# Altium project Smart wrist Band.PrjPcb
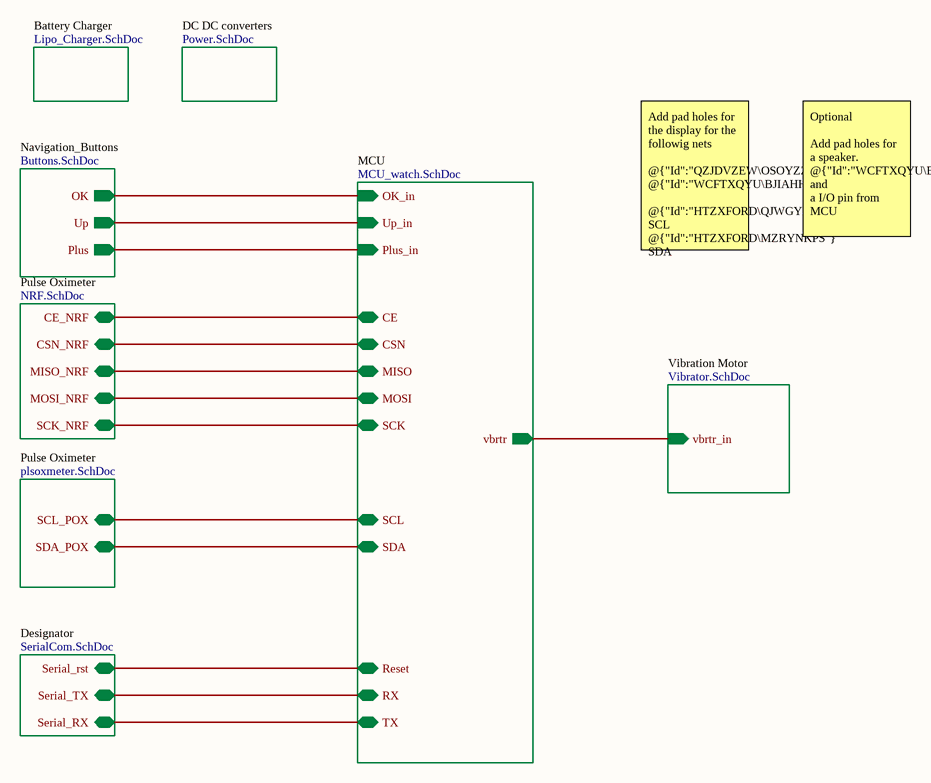
[diagram p0: Wrist watch main.SchDoc]
8 sheets, 63 parts. Net scope: hierarchical (ports join the sheet entries above them; power ports are global).
Sheets:
  Wrist watch main.SchDoc
    MCU = MCU_watch.SchDoc
    Pulse Oximeter = plsoxmeter.SchDoc
    Vibration Motor = Vibrator.SchDoc
    Navigation_Buttons = Buttons.SchDoc
  USB.SchDoc
  VRegulator.SchDoc
  Buck_converter.SchDoc

## Sheet Wrist watch main.SchDoc: Wrist watch main
size A4; Subtitle: Subtitle; Project: Stearsafe; VersionRevision: VersionRevision; TotalSheet: TotalSheet; Author: Sajitha Madugalle; Revision: 1; SheetNumber: 1; SheetTotal: 9

### Sub-sheets
Battery Charger = Lipo_Charger.SchDoc (file not in this document): no entries
DC DC converters = Power.SchDoc (file not in this document): no entries
Designator = SerialCom.SchDoc (file not in this document): Serial_rst (bidir), Serial_TX (bidir), Serial_RX (bidir)
MCU = MCU_watch.SchDoc: SDA (bidir), SCL (bidir), OK_in (in), Up_in (in), Plus_in (in), vbrtr (out), CE (bidir), CSN (bidir), MISO (bidir), MOSI (bidir), SCK (bidir), Reset (bidir), RX (bidir), TX (bidir)
Navigation_Buttons = Buttons.SchDoc: OK (out), Up (out), Plus (out)
Pulse Oximeter = plsoxmeter.SchDoc: SCL_POX (bidir), SDA_POX (bidir)
Pulse Oximeter = NRF.SchDoc (file not in this document): CE_NRF (bidir), CSN_NRF (bidir), MISO_NRF (bidir), MOSI_NRF (bidir), SCK_NRF (bidir)
Vibration Motor = Vibrator.SchDoc: vbrtr_in (in)

### Nets
RST: sheet MCU/Reset, sheet Designator/Serial_rst
SW1: sheet MCU/Up_in, sheet Navigation_Buttons/Up
SW2: sheet MCU/OK_in, sheet Navigation_Buttons/OK
SW3: sheet MCU/Plus_in, sheet Navigation_Buttons/Plus
NetIC2_2: sheet MCU/SCL, sheet Pulse Oximeter/SCL_POX
NetIC2_3: sheet MCU/SDA, sheet Pulse Oximeter/SDA_POX
NetR10_1: sheet MCU/vbrtr, sheet Vibration Motor/vbrtr_in
NetU1_11: sheet MCU/CSN, sheet Pulse Oximeter/CSN_NRF
NetU1_12: sheet MCU/CE, sheet Pulse Oximeter/CE_NRF
NetU1_15: sheet MCU/MOSI, sheet Pulse Oximeter/MOSI_NRF
NetU1_16: sheet MCU/MISO, sheet Pulse Oximeter/MISO_NRF
NetU1_17: sheet MCU/SCK, sheet Pulse Oximeter/SCK_NRF
NetU1_30: sheet MCU/RX, sheet Designator/Serial_TX
NetU1_31: sheet MCU/TX, sheet Designator/Serial_RX

### Notes on the sheet
- Add pad holes for the display for the followig nets
  @{"Id":"QZJDVZEW\OSOYZZOG"} @{"Id":"WCFTXQYU\BJIAHHOM"}
  @{"Id":"HTZXFORD\QJWGYBCR"} SCL
  @{"Id":"HTZXFORD\MZRYNKPS"} SDA
- Optional
  Add pad holes for a speaker. @{"Id":"WCFTXQYU\BJIAHHOM"} and
  a I/O pin from MCU
- Title:
- Size:
- Document Number :
- Revision
- Drawn by:
- Checked by:
- Date:
- A4
- Time:
- Aprooved by:
- Sheet:
- of
- File:

## Sheet MCU_watch.SchDoc: MCU_Watch
size A4; Author: Sajitha Madugalle; Revision: 1; SheetNumber: 5; SheetTotal: 8
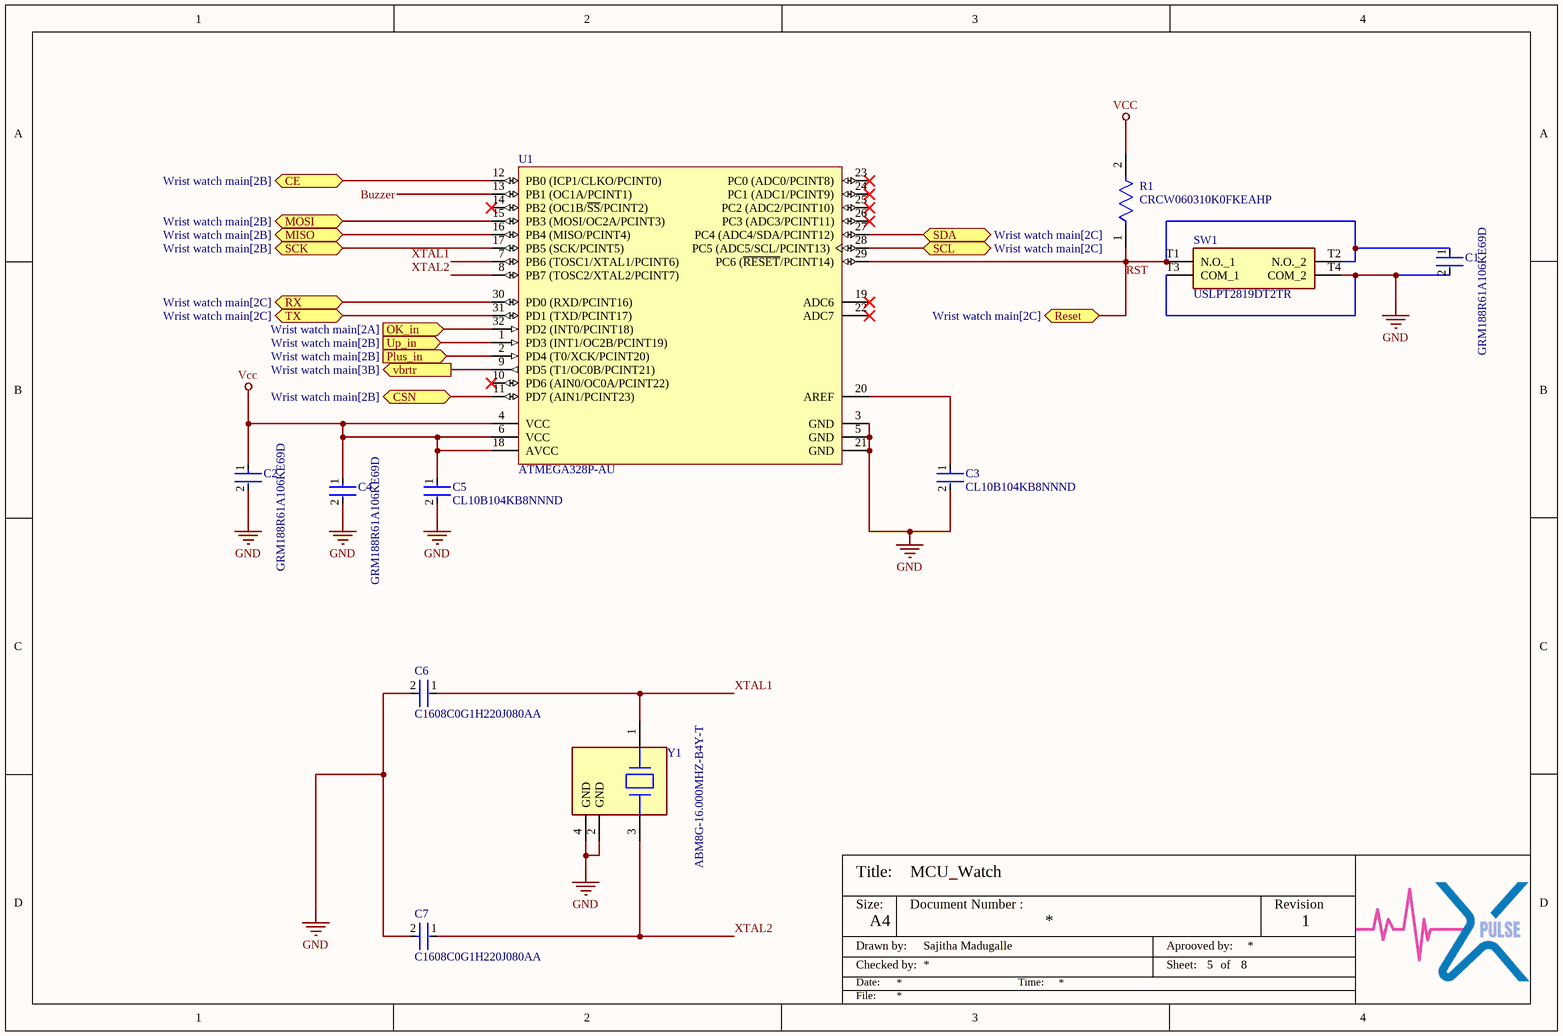
[diagram p1: MCU_watch.SchDoc]

### Parts
C1  GRM188R61A106KE69D  [FP-GRM18-0_15-MFG]
C2  GRM188R61A106KE69D  [FP-GRM18-0_15-MFG]
C3  CL10B104KB8NNND  [FP-CL10-IPC_A]
C4  GRM188R61A106KE69D  [FP-GRM18-0_15-MFG]
C5  CL10B104KB8NNND  [FP-CL10-IPC_A]
C6  C1608C0G1H220J080AA  [FP-C1608-080-0_1-IPC_B]
C7  C1608C0G1H220J080AA  [FP-C1608-080-0_1-IPC_B]
R1  CRCW060310K0FKEAHP  [FP-CRCW0603-HPe3-MFG]
SW1  USLPT2819DT2TR  [USLPT2819DT2TR]
U1  ATMEGA328P-AU  [ATML-32A_M]
Y1  ABM8G-16.000MHZ-B4Y-T  [FP-ABM8G-MFG]

### Ports
CE (bidir, see Wrist watch main[2B]), CSN (bidir, see Wrist watch main[2B]), MISO (bidir, see Wrist watch main[2B]), MOSI (bidir, see Wrist watch main[2B]), OK_in (in, see Wrist watch main[2A]), Plus_in (in, see Wrist watch main[2B]), Reset (bidir, see Wrist watch main[2C]), RX (bidir, see Wrist watch main[2C]), SCK (bidir, see Wrist watch main[2B]), SCL (bidir, see Wrist watch main[2C]), SDA (bidir, see Wrist watch main[2C]), TX (bidir, see Wrist watch main[2C]), Up_in (in, see Wrist watch main[2B]), vbrtr (out, see Wrist watch main[3B])

### Nets
GND: C1.2 C2.2 C3.2 C4.2 C5.2 C6.2 C7.2 SW1.T3(COM_1) SW1.T4(COM_2) U1.3(GND) U1.5(GND) U1.21(GND) Y1.2(GND) Y1.4(GND)
Vcc: C2.1 C4.1 C5.1 R1.2 U1.4(VCC) U1.6(VCC) U1.18(AVCC)
Buzzer: U1.13(PB1_(OC1A/PCINT1))
RST: C1.1 R1.1 SW1.T1(N.O._1) SW1.T2(N.O._2) U1.29(PC6_(~{RESET}/PCINT14)) ; port Reset
SW1: U1.1(PD3_(INT1/OC2B/PCINT19)) ; port Up_in
SW2: U1.32(PD2_(INT0/PCINT18)) ; port OK_in
SW3: U1.2(PD4_(T0/XCK/PCINT20)) ; port Plus_in
XTAL1: C6.1 U1.7(PB6_(TOSC1/XTAL1/PCINT6)) Y1.1
XTAL2: C7.1 U1.8(PB7_(TOSC2/XTAL2/PCINT7)) Y1.3
NetC3_1: C3.1 U1.20(AREF)
NetIC2_2: U1.28(PC5_(ADC5/SCL/PCINT13)) ; port SCL
NetIC2_3: U1.27(PC4_(ADC4/SDA/PCINT12)) ; port SDA
NetR10_1: U1.9(PD5_(T1/OC0B/PCINT21)) ; port vbrtr
NetU1_11: U1.11(PD7_(AIN1/PCINT23)) ; port CSN
NetU1_12: U1.12(PB0_(ICP1/CLKO/PCINT0)) ; port CE
NetU1_15: U1.15(PB3_(MOSI/OC2A/PCINT3)) ; port MOSI
NetU1_16: U1.16(PB4_(MISO/PCINT4)) ; port MISO
NetU1_17: U1.17(PB5_(SCK/PCINT5)) ; port SCK
NetU1_30: U1.30(PD0_(RXD/PCINT16)) ; port RX
NetU1_31: U1.31(PD1_(TXD/PCINT17)) ; port TX

Not connected (* = marked no-connect by the designer): U1 10(PD6_(AIN0/OC0A/PCINT22))* 14(PB2_(OC1B/~{SS}/PCINT2))* 19(ADC6)* 22(ADC7)* 23(PC0_(ADC0/PCINT8))* 24(PC1_(ADC1/PCINT9))* 25(PC2_(ADC2/PCINT10))* 26(PC3_(ADC3/PCINT11))*

### Notes on the sheet
- Title:
- Size:
- Document Number :
- Revision
- Drawn by:
- Checked by:
- Date:
- A4
- Time:
- Aprooved by:
- Sheet:
- of
- File:

### Library data of the parts
C1 C2 C4 = CMP-2000-05448-2: CAP CER 10UF 10V X5R 0603; Manufacturer: Murata; Temperature Coefficient: 15%; Material: Ceramic; Tolerance: 10%; Device Class L1: Passive Components; ComponentLink2Description: Datasheet; Height: 0.95mm; Package: GRM18-0.15; Octopart: https://octopart.com/grm188r61a106ke69d-murata-22851381; Manufacturer Part Number: GRM188R61A106KE69D; Value: 10uF; Digikey Description: CAP CER 10UF 10V X5R 0603; Temperature Range High: +85°C; Temperature Range Low: -55°C; Temperature Characteristic: X5R; Capacitance: 10uF; RoHS: TRUE; Device Class L2: Capacitors; ComponentLink2URL: https://search.murata.co.jp/Ceramy/image/img/A01X/G101/ENG/GRM188R61A106KE69-01A.pdf; Device Class L3: Ceramic Capacitors; Lead Free: Yes; Mouser Description: Multilayer Ceramic Capacitors MLCC - SMD/SMT 0603 10uF 10volts X5R + - 10%; Category: Cap; Voltage Rating: 10V; Temperature: -55°C to +85°C; Automotive: No
C3 C5 = CMP-13271-000587-1: Cap Ceramic 100nF 50V X7R ±10% Pad SMD 0603 +125°C T/R; Case/Package: 0603; Depth: 0.8mm; Max Operating Temperature: 125°C; Lead Free: Lead Free; Material: Ceramic; Voltage Rating: 50V; Min Operating Temperature: -55°C; Voltage Rating (DC): 50V; Dielectric: X7R; Height: 0.8mm; Capacitance: 100nF; Thickness: 0.035inch; Radiation Hardening: No; Voltage: 50V; Packaging: Tape and Reel; Length: 1.6mm; Tolerance: 10%; Width: 0.031inch; Mount: Surface Mount; Package Quantity: 10000
C6 C7 = CMP-2000-06024-2: CAP CER 22PF 50V C0G 0603; Tolerance: 5%; Temperature Coefficient: 30ppm/°C; Dielectric Material: Ceramic; Packaging: Tape and Reel; Termination: SMD/SMT; Case Code (Imperial): 0603; Height: 0.8mm; Capacitance: 22pF; Voltage: 50V; RoHS Compliant: Yes; Voltage Rating: 50V; Depth: 0.8mm; Case Code (Metric): 1608; Voltage Rating (DC): 50V; Construction: Flat; Max Operating Temperature: 125°C; Radiation Hardening: No; Lead Free: Lead Free; Number of Pins: 2; Case/Package: 0603; Thickness: 0.037inch; Min Operating Temperature: -55°C; Width: 0.031inch; Mount: Surface Mount; Weight: 7.1E-05oz; Series: C; Dielectric: C0G; Package Quantity: 1; Length: 1.6mm
R1 = CMP-2000-03835-2: RES SMD 10K OHM 1% 1/3W 0603; Resistance: 10kR; Voltage Rating (DC): 75V; Max Power Dissipation: 250mW; Temperature Coefficient: 100ppm/°C; Case Code (Metric): 1608; Features: Automotive AEC-Q200; Termination: SMD/SMT; Number of Terminations: 2; Case Code (Imperial): 0603; Tolerance: 1%; Depth: 0.85mm; Package Quantity: 10; Length: 1.6mm; Packaging: Tape and Reel; Contact Plating: Tin; Radiation Hardening: No; Case/Package: 0603; Composition: Thick Film; Voltage Rating: 75V; Weight: 7.1E-05oz; Max Operating Temperature: 155°C; Lead Free: Lead Free; Width: 0.033inch; Power Rating: 250mW; Min Operating Temperature: -55°C; Military Standard: Not; Height: 0.45mm
SW1 = USLPT2819DT2TR: Switch; Manufacturer_Name: TE Connectivity; Datasheet Link: https://www.te.com/commerce/DocumentDelivery/DDEController?Action=srchrtrv&DocNm=2337225-1&DocType=Data%20Sheet&DocLang=English&PartCntxt=2337225-1&DocFormat=pdf; Height: 0.6mm; Manufacturer_Part_Number: USLPT2819DT2TR; Mouser Part Number: 506-USLPT2819DT2TR; Mouser Price/Stock: https://www.mouser.co.uk/ProductDetail/TE-Connectivity-PB/USLPT2819DT2TR?qs=qSfuJ%252Bfl%2Fd7zUoyEnK5Yzg%3D%3D; Arrow Part Number: USLPT2819DT2TR; Arrow Price/Stock: https://www.arrow.com/en/products/uslpt2819dt2tr/te-connectivity?region=nac
U1 = CMP-020-00003-3: 8-Bit Microcontroller with 32 KBytes In-System Programmable Flash, 23 I/Os, -40 to 85 degC, 32-Pin TQFP (32A), RoHS, Tray; Manufacturer: Atmel; PWM Channels: 6; Frequency: 20MHz; RAM Size: 2KB; ADC Channels: 8; Max Supply Voltage: 5.5V; Density: 32KB; USB Channels: 0; I/Os: 23; Min Supply Voltage: 1.8V; Interface: USART; Package Reference: 32A; Package Description: 32-Pin Thin Profile Plastic Quad Flat Package, Body 7 x 7 mm, Pitch 0.8 mm; Max Operating Temperature: 85°C; Mounting Technology: SM; Datasheet URL: http://www.atmel.com/images/Atmel-8271-8-bit-AVR-Microcontroller-ATmega48A-48PA-88A-88PA-168A-168PA-328-328P_datasheet_Complete.pdf; Pins: 32; Packaging: Tray; RoHS Compliant: True; Max Clock Frequency: 20MHz; Ethernet Channels: 0; Clock Frequency: 20MHz; Case/Package: TQFP; Manufacturer URL: http://www.atmel.com/; Datasheet Version: Rev. 8271J, 11/2015; Package Quantity: 250; Min Operating Temperature: -40°C
Y1 = CMP-27762-015167-1: Crystal 16MHz ±30ppm (Tol) ±30ppm (Stability) 10pF FUND 80Ω 4-Pin SMD T/R; ESR (Equivalent Series Resistance): 80R; Package Quantity: 1000; Frequency: 16MHz; Length: 3.2mm; Tolerance: 30ppm; Frequency Stability: 30ppm; Depth: 2.5mm; Termination: SMD/SMT; Number of Pins: 4; Max Operating Temperature: 70°C; Min Operating Temperature: -20°C; Mount: Surface Mount; Lead Free: Lead Free; Frequency Tolerance: 30ppm; Width: 2.5mm; Series: ABM8G; Load Capacitance: 10pF; Operating Frequency: 16 MHz; Case/Package: CSMD; Height: 1mm; Packaging: Tape and Reel

## Sheet plsoxmeter.SchDoc: Pulse oximeter
size A4; Revision: 1; SheetNumber: 5; SheetTotal: 9
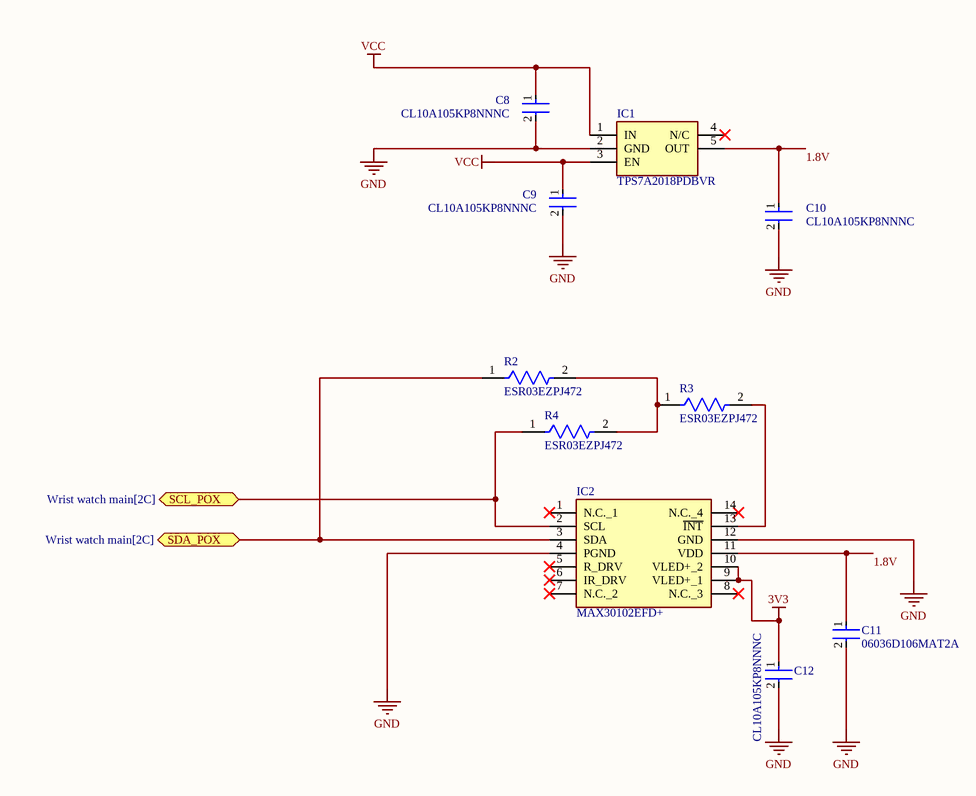
[diagram p2: plsoxmeter.SchDoc]

### Parts
C8  CL10A105KP8NNNC  [FP-CL10-IPC_C]
C9  CL10A105KP8NNNC  [FP-CL10-IPC_C]
C10  CL10A105KP8NNNC  [FP-CL10-IPC_C]
C11  06036D106MAT2A  [FP-0603-L_1_6_0_15-W_0_81-IPC_B]
C12  CL10A105KP8NNNC  [FP-CL10-IPC_C]
IC1  TPS7A2018PDBVR  [SOT95P280X145-5N]
IC2  MAX30102EFD+  [14-LEAD-OESIP]
R2  ESR03EZPJ472  [FP-ESR03-IPC_A]
R3  ESR03EZPJ472  [FP-ESR03-IPC_A]
R4  ESR03EZPJ472  [FP-ESR03-IPC_A]

### Ports
SCL_POX (bidir, see Wrist watch main[2C]), SDA_POX (bidir, see Wrist watch main[2C])

### Nets
3V3: C12.1 IC2.9(VLED+_1) IC2.10(VLED+_2)
GND: C8.2 C9.2 C10.2 C11.2 C12.2 IC1.2(GND) IC2.4(PGND) IC2.12(GND)
Vcc: C8.1 C9.1 IC1.1(IN) IC1.3(EN)
1.8V: C10.1 C11.1 IC1.5(OUT) IC2.11(VDD)
NetIC2_2: IC2.2(SCL) R4.1 ; port SCL_POX
NetIC2_3: IC2.3(SDA) R2.1 ; port SDA_POX
NetIC2_13: IC2.13(~{INT}) R3.2
NetR2_2: R2.2 R3.1 R4.2

Not connected (* = marked no-connect by the designer): IC1 4(N/C)*; IC2 1(N.C._1)* 5(R_DRV)* 6(IR_DRV)* 7(N.C._2)* 8(N.C._3)* 14(N.C._4)*

### Notes on the sheet
- Title:
- Size:
- Document Number :
- Revision
- Drawn by:
- Checked by:
- Date:
- A4
- Time:
- Aprooved by:
- Sheet:
- of
- File:
- URL:

### Library data of the parts
C8-C10 C12 = CMP-13271-003399-1: Cap Ceramic 1uF 10V X5R ±10% Pad SMD 0603 +85°C T/R; Min Operating Temperature: -55°C; Max Operating Temperature: 85°C; Dielectric: X5R; Contact Plating: Tin; Height: 0.8mm; Voltage: 10V; Packaging: Tape and Reel; Voltage Rating: 10V; Capacitance: 1uF; Package Quantity: 1; Width: 0.031inch; Length: 1.6mm; Depth: 0.8mm; Case/Package: 0603; Case Code (Imperial): 0603; Thickness: 0.035inch; Radiation Hardening: No; Tolerance: 10%; Case Code (Metric): 1608; Mount: Surface Mount
C11 = CMP-2006-04476-2: General Purpose Ceramic Capacitor, 0603, 10uF, 20%, X5R, 15%, 6.3V; RoHS Compliant: Yes; Case Code (Imperial): 0603; Construction: Flat; Thickness: 0.035inch; Height: 0.9mm; Number of Pins: 2; Max Operating Temperature: 85°C; Capacitance: 10uF; Length: 1.6mm; REACH SVHC: No SVHC; Width: 0.032inch; Voltage Rating (DC): 6.3V; Termination: SMD/SMT; Contact Plating: Tin; Min Operating Temperature: -55°C; Depth: 0.81mm; Packaging: Tape and Reel; Case Code (Metric): 1608; Voltage Rating: 6.3V; Lead Free: Lead Free; Mount: Surface Mount; Radiation Hardening: No; Series: -; Dielectric Material: Ceramic; Package Quantity: 1; Case/Package: 0603; Tolerance: 20%; Dielectric: X5R; Voltage: 6.3V
IC1 = TPS7A2018PDBVR: Integrated Circuit; Manufacturer_Name: Texas Instruments; Datasheet Link: https://datasheet.datasheetarchive.com/originals/distributors/Datasheets_SAMA/e65d9d311cedf91014769949f3101225.pdf; Height: 1.45mm; Manufacturer_Part_Number: TPS7A2018PDBVR; Mouser Part Number: 595-TPS7A2018PDBVR; Mouser Price/Stock: https://www.mouser.co.uk/ProductDetail/Texas-Instruments/TPS7A2018PDBVR?qs=hd1VzrDQEGheW9qdrIVGew%3D%3D; Arrow Part Number: TPS7A2018PDBVR; Arrow Price/Stock: https://www.arrow.com/en/products/tps7a2018pdbvr/texas-instruments?region=nac
IC2 = MAX30102EFD+: Integrated Circuit; Manufacturer_Name: Analog Devices; Datasheet Link: https://datasheets.maximintegrated.com/en/ds/MAX30102.pdf; Manufacturer_Part_Number: MAX30102EFD+; Mouser Part Number: 700-MAX30102EFD+; Mouser Price/Stock: https://www.mouser.co.uk/ProductDetail/Analog-Devices-Maxim-Integrated/MAX30102EFD%2b?qs=nVS1qgv%252BQrk9UYEvS27V%2Fg%3D%3D
R2-R4 = CMP-08839-007853-1: 4.7kΩ ±5% 0.25W 0603 Anti-Surge Chip Resistor AEC-Q200; Max Power Dissipation: 250mW; Resistance: 4.7kR; Temperature Coefficient: 200ppm/°C; Packaging: Tape and Reel; Series: ESR; Height: 0.022inch; Case Code (Imperial): 0603; Tolerance: 5%; RoHS Compliant: Yes; Case/Package: 0603; Min Operating Temperature: -55°C; Resistor Type: Thick Film; Package Quantity: 5000; Features: Automotive AEC-Q200; Width: 0.031inch; Length: 0.063inch; Max Operating Temperature: 155°C; Number of Terminations: 2

## Sheet Vibrator.SchDoc: Vibration motor
size A4; Author: Sajitha Madugalle; Revision: 1; SheetNumber: 6; SheetTotal: 9
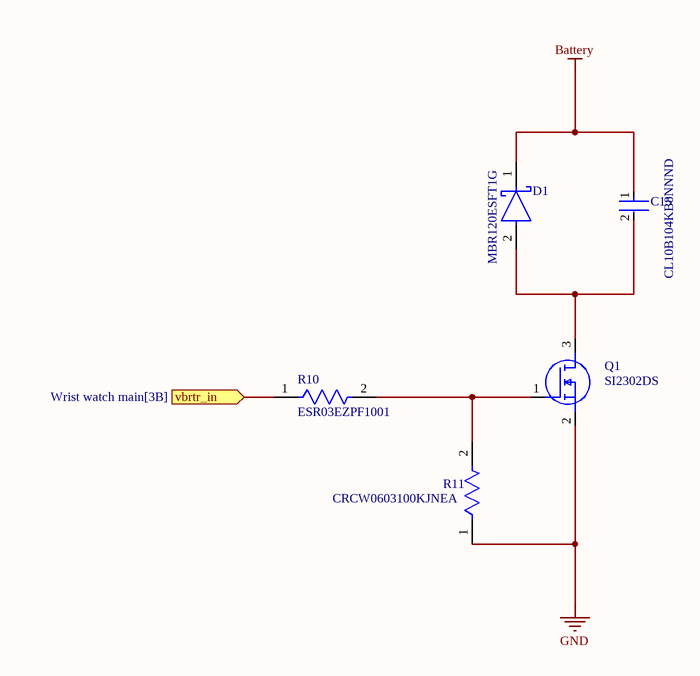
[diagram p3: Vibrator.SchDoc]

### Parts
C15  CL10B104KB8NNND  [FP-CL10-IPC_A]
D1  MBR120ESFT1G  [On_Semiconductor_498_MFG]
Q1  SI2302DS  [SOT95P230X110-3N]
R10  ESR03EZPF1001  [FP-ESR03-IPC_A]
R11  CRCW0603100KJNEA  [FP-CRCW0603-e3-IPC_C]

### Ports
vbrtr_in (in, see Wrist watch main[3B])

### Nets
Battery: C15.1 D1.1(C)
GND: Q1.2(S) R11.1
NetC15_2: C15.2 D1.2(A) Q1.3(D)
NetQ1_1: Q1.1(G) R10.2 R11.2
NetR10_1: R10.1 ; port vbrtr_in

### Notes on the sheet
- Title:
- Size:
- Document Number :
- Revision
- Drawn by:
- Checked by:
- Date:
- A4
- Time:
- Aprooved by:
- Sheet:
- of
- File:

### Library data of the parts
C15 = CMP-13271-000587-1: as C3 on sheet MCU_watch; Case/Package: 0603; Depth: 0.8mm; Max Operating Temperature: 125°C; Lead Free: Lead Free; Material: Ceramic; Voltage Rating: 50V; Min Operating Temperature: -55°C; Voltage Rating (DC): 50V; Dielectric: X7R; Height: 0.8mm; Capacitance: 100nF; Thickness: 0.035inch; Radiation Hardening: No; Voltage: 50V; Packaging: Tape and Reel; Length: 1.6mm; Tolerance: 10%; Width: 0.031inch; Mount: Surface Mount; Package Quantity: 10000
D1 = CMP-1055-00434-2: NexarPartId: 330787; Manufacturer Lifecycle Status: ACTIVE; Voltage Rating (DC): 20V; Max Forward Surge Current (Ifsm): 40A; Output Current: 1A; Max Junction Temperature (Tj): 150°C; Polarity: Standard; Peak Reverse Current: 10µA; Element Configuration: Single; Forward Voltage: 530mV; Lifecycle Status: Production; Packaging: Cut Tape; Lead Free: Lead Free; Radiation Hardening: No; Min Operating Temperature: -65°C; Average Rectified Current: 1A; Current Rating: 1A; Max Reverse Voltage (DC): 20V; RoHS: Compliant; REACH SVHC: No SVHC; Max Surge Current: 40A; Length: 2.9mm; Forward Current: 1A; Height: 880µm; Contact Plating: Tin; Width: 1.8mm; Reverse Voltage: 20V; Schedule B: 8541100080; Peak Non-Repetitive Surge Current: 40A; Max Operating Temperature: 150°C; Max Repetitive Reverse Voltage (Vrrm): 20V; Max Reverse Leakage Current: 10µA; Number of Pins: 2; Halogen Free: Halogen Free
Q1 = SI2302DS: MOSFET (N-Channel); Manufacturer_Name: Nexperia; Datasheet Link: https://assets.nexperia.com/documents/data-sheet/SI2302DS.pdf; Height: 1.1mm; Manufacturer_Part_Number: SI2302DS; Mouser Part Number: N/A; Mouser Price/Stock: https://www.mouser.com/Search/Refine.aspx?Keyword=N%2FA
R10 = CMP-08839-029483-1: 1kΩ ±1% 0.25W 0603 Anti-Surge Chip Resistor AEC-Q200; Power Rating: 250mW; Resistance: 1kR; Temperature Coefficient: 100ppm/°C; Series: ESR; Max Operating Temperature: 155°C; Case Code (Metric): 1608; Package Quantity: 1; Case/Package: 0603; Size Code: 0603; Case Code (Imperial): 0603; Min Operating Temperature: -55°C; Tolerance: 1%; Max Power Dissipation: 250mW; Number of Terminations: 2; RoHS Compliant: Yes; Lead Free: Lead Free; Packaging: Tape and Reel; Height: 0.022inch; Width: 0.031inch; Features: Automotive AEC-Q200; Resistor Type: Thick Film; Length: 0.063inch
R11 = CMP-2000-03823-2: RES Thick Film, 100kΩ, 5%, 0.1W, 200ppm/°C, 0603; Power Rating: 100mW; Voltage Rating: 75V; Resistance: 100kR; Radiation Hardening: No; Min Operating Temperature: -55°C; Width: 0.85mm; Case Code (Metric): 1608; Max Power Dissipation: 100mW; Composition: Thick Film; Temperature Coefficient: 200ppm/°C; Tolerance: 5%; Termination: SMD/SMT; Military Standard: Not; Weight: 7.1E-05oz; Number of Pins: 2; Mount: Surface Mount; Depth: 0.85mm; Max Operating Temperature: 155°C; Case/Package: 0603; Working Voltage: 75V; Number of Terminations: 2; Package Quantity: 1; Case Code (Imperial): 0603; Contact Plating: Tin; Length: 1.55mm; Packaging: Tape and Reel; Height: 0.02inch; Features: Automotive AEC-Q200

## Sheet Buttons.SchDoc
size A4; Subtitle: Subtitle; Project: Project; VersionRevision: VersionRevision; TotalSheet: TotalSheet; SheetNumber: 7; SheetTotal: 9
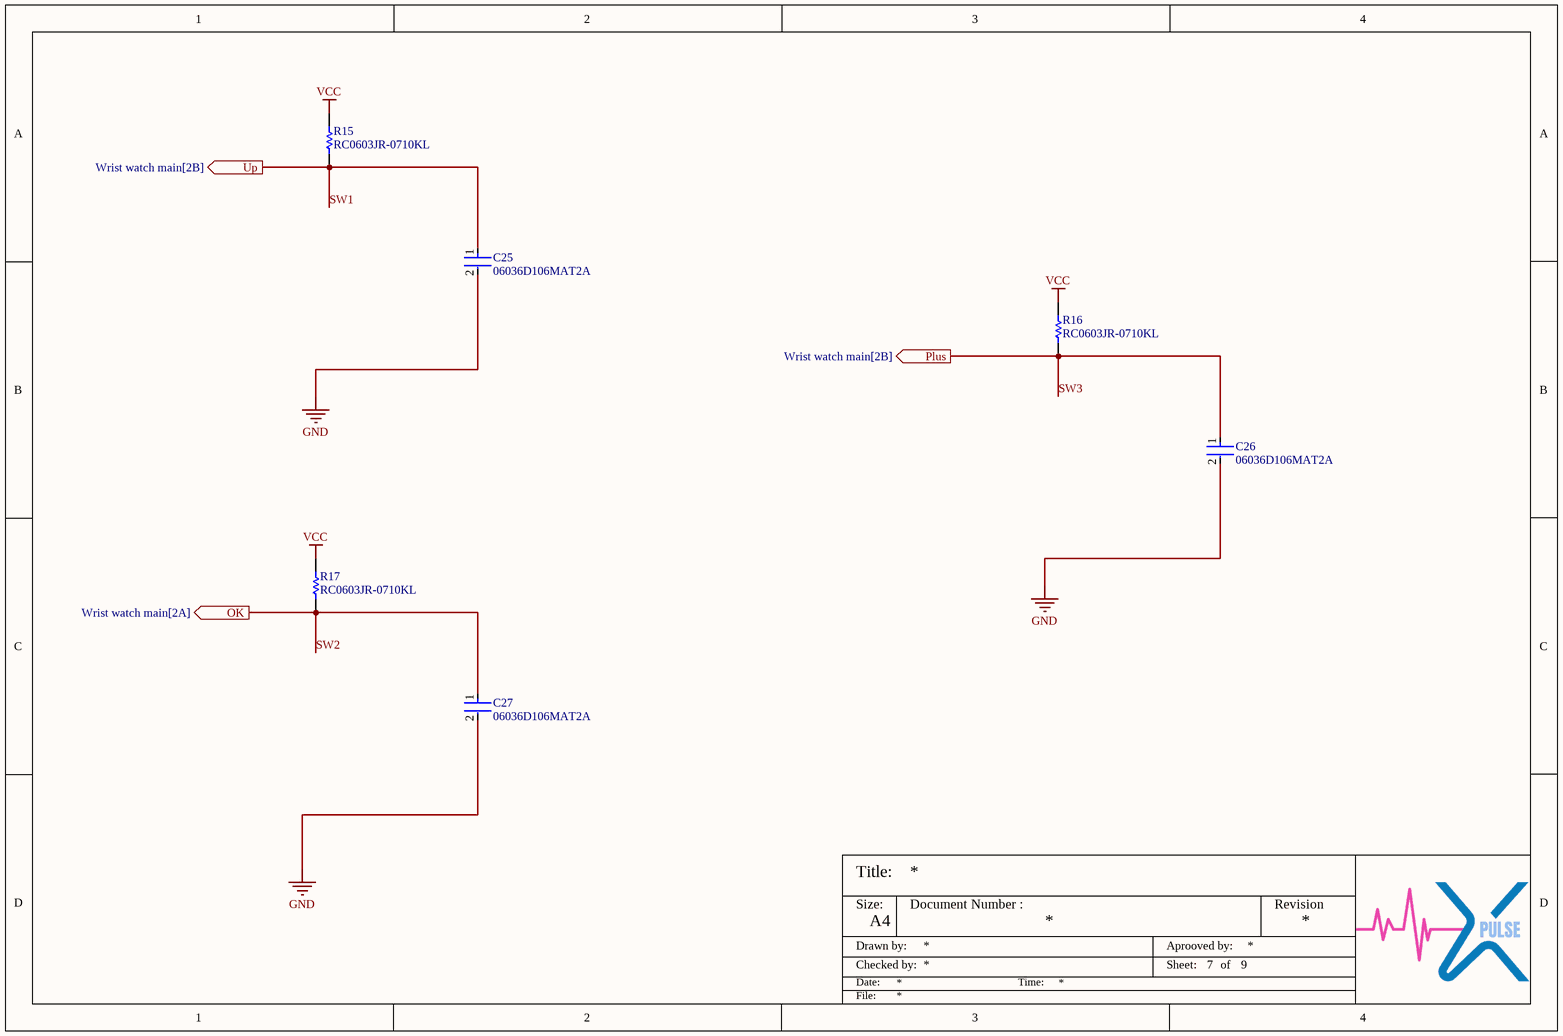
[diagram p4: Buttons.SchDoc]

### Parts
C25  06036D106MAT2A  [FP-0603-L_1_6_0_15-W_0_81-IPC_B]
C26  06036D106MAT2A  [FP-0603-L_1_6_0_15-W_0_81-IPC_B]
C27  06036D106MAT2A  [FP-0603-L_1_6_0_15-W_0_81-IPC_B]
R15  RC0603JR-0710KL  [RESC1608X55X25ML10T15]
R16  RC0603JR-0710KL  [RESC1608X55X25ML10T15]
R17  RC0603JR-0710KL  [RESC1608X55X25ML10T15]

### Ports
OK (out, see Wrist watch main[2A]), Plus (out, see Wrist watch main[2B]), Up (out, see Wrist watch main[2B])

### Nets
GND: C25.2 C26.2 C27.2
Vcc: R15.2 R16.2 R17.2
SW1: C25.1 R15.1 ; port Up
SW2: C27.1 R17.1 ; port OK
SW3: C26.1 R16.1 ; port Plus

### Notes on the sheet
- Title:
- Size:
- Document Number :
- Revision
- Drawn by:
- Checked by:
- Date:
- A4
- Time:
- Aprooved by:
- Sheet:
- of
- File:

### Library data of the parts
C25-C27 = CMP-2006-04476-2: as C11 on sheet plsoxmeter; RoHS Compliant: Yes; Case Code (Imperial): 0603; Construction: Flat; Thickness: 0.035inch; Height: 0.9mm; Number of Pins: 2; Max Operating Temperature: 85°C; Capacitance: 10uF; Length: 1.6mm; REACH SVHC: No SVHC; Width: 0.032inch; Voltage Rating (DC): 6.3V; Termination: SMD/SMT; Contact Plating: Tin; Min Operating Temperature: -55°C; Depth: 0.81mm; Packaging: Tape and Reel; Case Code (Metric): 1608; Voltage Rating: 6.3V; Lead Free: Lead Free; Mount: Surface Mount; Radiation Hardening: No; Series: -; Dielectric Material: Ceramic; Package Quantity: 1; Case/Package: 0603; Tolerance: 20%; Dielectric: X5R; Voltage: 6.3V
R15-R17 = CMP-2000-05022-1: Resistor, 10 KOhm, +/- 5%, 100 mW, -55 to 155 degC, 0603 (1608 Metric), RoHS, Tape and Reel; Manufacturer: Yageo; Resistance: 10kOhms; Voltage Rating: 50V; Temperature Coefficient: 100PPM/C; Power Rating: 100mW; Package Reference: 603; Series: RC; Case Code - mm: 1608; Packaging: Reel; Datasheet URL: http://www.farnell.com/datasheets/443971.pdf; Datasheet Version: Rev. 4, 04/2009; Operating Temperature Range: -55Cto+155C; Product: ThickFilmResistorsGeneralPurpose; Package Description: 2-Pin Surface Mount Device, Body 1.6 x 0.8 mm; Manufacturer URL: http://www.yageo.com/; Case Code - in: 0603; Tolerance: 5%; Termination Style: SMD/SMT

## Sheet USB.SchDoc: USB_Charger
size A4; Author: Sajitha Madugalle; Revision: 1; SheetNumber: 5; SheetTotal: 7
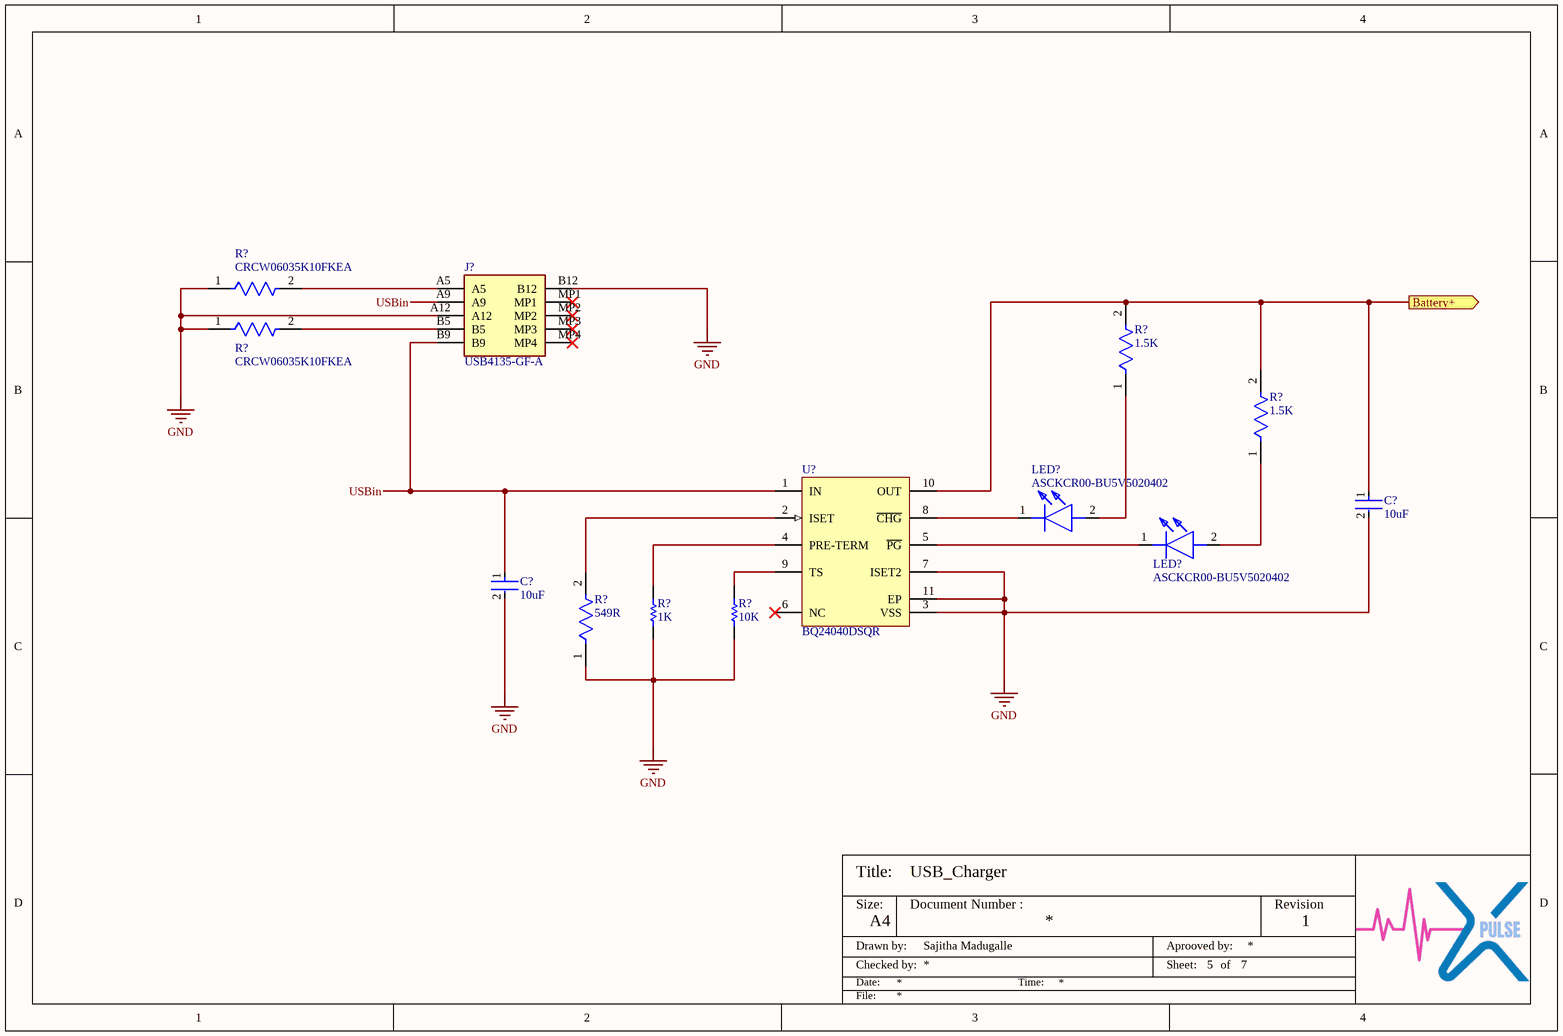
[diagram p5: USB.SchDoc]

### Parts
(Parts that share a designator on the sheet are numbered #1, #2 ... from top to bottom, then left to right.)
C?#1  10uF  [FP-CL10-IPC_A]
C?#2  10uF  [FP-CL10-IPC_A]
J?  USB4135-GF-A  [USB4135GFA]
LED?#1  ASCKCR00-BU5V5020402  [ASCKCR00BU5V5020402]
LED?#2  ASCKCR00-BU5V5020402  [ASCKCR00BU5V5020402]
R?#1  CRCW06035K10FKEA  [FP-CRCW0603-e3-IPC_C]
R?#2  CRCW06035K10FKEA  [FP-CRCW0603-e3-IPC_C]
R?#3  1.5K  [FP-CRCW0603-e3-IPC_A]
R?#4  1.5K  [FP-CRCW0603-e3-IPC_A]
R?#5  1K  [RESC1609X50X30NL8T20]
R?#6  10K  [RESC1609X50X30NL8T20]
R?#7  549R  [FP-CRCW0603-e3-IPC_B]
U?#1  BQ24040DSQR  [DSQ0010A_V]

### Ports
Battery+ (out)

### Nets
GND: C?#1.2 C?#2.2 J?.A12 J?.B12 R?#1.1 R?#2.1 R?#5.1 R?#6.1 R?#7.1 U?#1.3(VSS) U?#1.7(ISET2) U?#1.11(EP)
USBin: C?#2.1 J?.A9 J?.B9 U?#1.1(IN)
NetC?#1_1: C?#1.1 R?#3.2 R?#4.2 U?#1.10(OUT) ; port Battery+
NetJ?_A5: J?.A5 R?#1.2
NetJ?_B5: J?.B5 R?#2.2
NetLED?#1_1: LED?#1.1(K) U?#1.8(~{CHG})
NetLED?#1_2: LED?#1.2(A) R?#3.1
NetLED?#2_1: LED?#2.1(K) U?#1.5(~{PG})
NetLED?#2_2: LED?#2.2(A) R?#4.1
NetR?#5_2: R?#5.2 U?#1.4(PRE-TERM)
NetR?#6_2: R?#6.2 U?#1.9(TS)
NetR?#7_2: R?#7.2 U?#1.2(ISET)

Not connected (* = marked no-connect by the designer): J? MP1* MP2* MP3* MP4*; U?#1 6(NC)*

### Notes on the sheet
- Title:
- Size:
- Document Number :
- Revision
- Drawn by:
- Checked by:
- Date:
- A4
- Time:
- Aprooved by:
- Sheet:
- of
- File:

### Library data of the parts
C?#1 C?#2 = CMP-13271-000587-1: as C3 on sheet MCU_watch; Case/Package: 0603; Depth: 0.8mm; Max Operating Temperature: 125°C; Lead Free: Lead Free; Material: Ceramic; Voltage Rating: 50V; Min Operating Temperature: -55°C; Voltage Rating (DC): 50V; Dielectric: X7R; Height: 0.8mm; Capacitance: 100nF; Thickness: 0.035inch; Radiation Hardening: No; Voltage: 50V; Packaging: Tape and Reel; Length: 1.6mm; Tolerance: 10%; Width: 0.031inch; Mount: Surface Mount; Package Quantity: 10000
J? = USB4135-GF-A: Connector; Manufacturer_Name: GCT (GLOBAL CONNECTOR TECHNOLOGY); Datasheet Link: https://ar.mouser.com/datasheet/2/837/usb4135-2930399.pdf; Height: 3.5mm; Manufacturer_Part_Number: USB4135-GF-A; Mouser Part Number: 640-USB4135-GF-A; Mouser Price/Stock: https://www.mouser.co.uk/ProductDetail/GCT/USB4135-GF-A?qs=Li%252BoUPsLEnt6HRo6RUvaXA%3D%3D
LED?#1 LED?#2 = ASCKCR00-BU5V5020402: LED; Manufacturer_Name: Avago Technologies; Datasheet Link: https://docs.broadcom.com/doc/ASCKCx00-xxxxx0x0x02-DS; Height: 0.75mm; Manufacturer_Part_Number: ASCKCR00-BU5V5020402; Mouser Part Number: 630-ASCKCR00BU5V5020; Mouser Price/Stock: https://www.mouser.co.uk/ProductDetail/Broadcom-Avago/ASCKCR00-BU5V5020402?qs=OcgtsXO%252B3gu355%2FiA8jcWA%3D%3D
R?#1 R?#2 = CMP-1012-00590-3: RES Thick Film, 5.1kΩ, 1%, 0.1W, 100ppm/°C, 0603; Power Rating: 100mW; Voltage Rating (DC): 75V; Resistance: 5.1kR; Width: 0.85mm; Depth: 0.85mm; Military Standard: Not; Package Quantity: 5000; Case Code (Metric): 1608; Length: 1.55mm; Weight: 7.1E-05oz; Packaging: Tape and Reel; Temperature Coefficient: 100ppm/°C; Case Code (Imperial): 0603; Lead Free: Lead Free; Radiation Hardening: No; Contact Plating: Tin; Composition: Thick Film; Max Operating Temperature: 155°C; Termination: SMD/SMT; Case/Package: 0603; Min Operating Temperature: -55°C; Tolerance: 1%; Voltage Rating: 75V; Mount: Surface Mount; Height: 0.45mm
R?#3 R?#4 = CMP-2000-02995-2: RES Thick Film, 1.5kΩ, 1%, 0.1W, 100ppm/°C, 0603; Working Voltage: 75V; Power Rating: 100mW; Resistance: 1.5kR; Max Operating Temperature: 155°C; Features: Automotive AEC-Q200; Min Operating Temperature: -55°C; Width: 0.033inch; Case/Package: 0603; Voltage Rating (DC): 75V; Termination: SMD/SMT; Mount: Surface Mount; Weight: 7.1E-05oz; Case Code (Metric): 1608; Height: 0.45mm; Voltage Rating: 75V; Length: 1.55mm; Package Quantity: 10; Lead Free: Lead Free; Composition: Thick Film; Packaging: Tape and Reel; Temperature Coefficient: 100ppm/°C; Tolerance: 1%; Military Standard: Not; Case Code (Imperial): 0603; Number of Terminations: 2; Max Power Dissipation: 100mW; Depth: 0.85mm; Contact Plating: Tin
R?#5 R?#6 = CMP-1666-00005-4: Chip Resistor, 10 KOhm, +/- 1%, 100 mW, -55 to 155 degC, 0603 (1608 Metric), RoHS, Tape and Reel; Manufacturer: Vishay Semiconductor; Voltage Rating: 75 V; Max Operating Temperature: 155 degC; PackageDescription: 2-Pin Surface Mount Device, Body 1.575 x 0.85 mm; ComponentLink1Description: Manufacturer URL; RoHSCompliant: true; PackageReference: 0603; REACH SVHC: Unknown; Length: 1.55 mm; DatasheetVersion: 06/2012; Packaging: Tape and Reel; Min Operating Temperature: -55 degC; Mounting Technology: Surface Mount; ComponentLink2URL: https://datasheet.ciiva.com/11809/0900766b80d98afc-11809037.pdf; Height: 0.45 mm; ComponentLink2Description: Datasheet; Package Quantity: 5000; ComponentLink1URL: http://www.vishay.com/
R?#7 = CMP-2000-03457-2: RES Thick Film, 549Ω, 1%, 0.1W, 100ppm/°C, 0603; Power Rating: 100mW; Voltage Rating: 75V; Composition: Thick Film; Resistance: 549R; Packaging: Tape and Reel; Max Operating Temperature: 155°C; Features: Automotive AEC-Q200; Temperature Coefficient: 100ppm/°C; Number of Terminations: 2; Radiation Hardening: No; Height: 0.45mm; Min Operating Temperature: -55°C; Width: 0.033inch; Number of Pins: 2; Contact Plating: Tin; Tolerance: 1%; Weight: 7.1E-05oz; Length: 1.55mm; Max Power Dissipation: 100mW; Depth: 0.85mm; Case Code (Metric): 1608; Case Code (Imperial): 0603; Package Quantity: 10; Military Standard: Not; Case/Package: 0603; Termination: SMD/SMT
U?#1 = CMP-0321-00456-2: 800 mA, Single-Input, Single Cell Li-Ion Battery Charger with Auto Start. Vovp=6.6 V, 3.5 V, -40 to 85 degC, 10-pin SON (DSQ), Green (RoHS & no Sb/Br); Manufacturer: Texas Instruments; NiCd: N; Vin(Min)(V): 3.5; SubFamily: Battery Charge Management; PackageDescription: 10-Pin Plastic Small Outline No-Lead, 2 x 2 x 0.8 mm Body, 0.4 mm Pitch, Exposed Pad; PackageVersion: revB, Apr-2010; Mounting Technology: Surface Mount; Eco-Plan: Green (RoHS & no Sb/Br); ComponentLink1URL: http://www.ti.com/general/docs/lit/getliterature.tsp?genericPartNumber=BQ24040&fileType=pdf; PartNumber: BQ24040DSQR; DatasheetVersion: SLUS941A; Over Voltage Protection: N; PackageReference: DSQ0010A; NiMH: N; Li-Ion: N; Lead Acid: N; Li-Polymer: N; ComponentLink1Description: Datasheet

## Sheet VRegulator.SchDoc: Title
size A4; Date: *******; ApprovedBy: *******; CheckedBy: None; Author: *******; CompanyName: *******; DrawnBy: Name; Engineer: *******; Organization: *******; Address1: *******; Address2: *******; Address3: *******; Address4: *******; DocumentNumber: Doc Num; Revision: *******; SheetNumber: 6; SheetTotal: 7; Subtitle: Subtitle; Project: Project; VersionRevision: VersionRevision; TotalSheet: TotalSheet; CurrentTime: *******; CurrentDate: *******; Time: *******; DocumentFullPathAndName: *******; DocumentName: *******; ModifiedDate: *******; ImagePath: *******; ProjectName: *******; Application_BuildNumber: *******
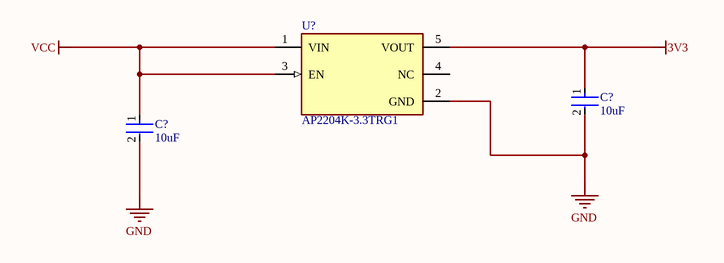
[diagram p6: VRegulator.SchDoc]

### Parts
(Parts that share a designator on the sheet are numbered #1, #2 ... from top to bottom, then left to right.)
C?#3  10uF  [FP-CL10-IPC_A]
C?#4  10uF  [FP-CL10-IPC_A]
U?#2  AP2204K-3.3TRG1  [FP-SOT25-IPC_C]

### Nets
3V3: C?#3.1 U?#2.5(VOUT)
GND: C?#3.2 C?#4.2 U?#2.2(GND)
Vcc: C?#4.1 U?#2.1(VIN) U?#2.3(EN)

Not connected (* = marked no-connect by the designer): U?#2 4(NC)

### Notes on the sheet
- Title:
- Drawn By:
- Page Contents:
- Checked By:
- Subtitle:
- University Of Moratuwa
- Moratuwa
- Size:
- Date:
- File:
- Email:
- A4
- lasithnawanjaan123@gmail.com
- Lasith Haputhanthri
- Number:
- Time:
- Revision:
- Sheet
- of
- Katubedda
- 10500
- Sri Lanka

### Library data of the parts
C?#3 C?#4 = CMP-13271-000587-1: as C3 on sheet MCU_watch; Case/Package: 0603; Depth: 0.8mm; Max Operating Temperature: 125°C; Lead Free: Lead Free; Material: Ceramic; Voltage Rating: 50V; Min Operating Temperature: -55°C; Voltage Rating (DC): 50V; Dielectric: X7R; Height: 0.8mm; Capacitance: 100nF; Thickness: 0.035inch; Radiation Hardening: No; Voltage: 50V; Packaging: Tape and Reel; Length: 1.6mm; Tolerance: 10%; Width: 0.031inch; Mount: Surface Mount; Package Quantity: 10000
U?#2 = CMP-2000-05782-2: IC REG LINEAR 3.3V 150MA SOT23-5; Max Input Voltage: 24V; Min Input Voltage: 2.3V; Quiescent Current: 50uA; Number of Regulators: 1; Max Output Current: 250mA; Reference Voltage: 1.24V; Output Type: Fixed; Polarity: Positive; Dropout Voltage: 360mV; Weight: 0.001058oz; Min Operating Temperature: -40°C; Output Current: 150mA; Lead Free: Lead Free; Length: 3.02mm; Height: 1.3mm; Width: 1.7mm; Case/Package: SOT-23-5; Max Operating Temperature: 85°C; Package Quantity: 3000; Mount: Surface Mount; Output Voltage: 3.3V; Number of Pins: 5; Packaging: Tape and Reel; Number of Outputs: 1

## Sheet Buck_converter.SchDoc: DC DC converter
size A4; Author: Sajitha Madugalle; Revision: 1; SheetNumber: 7; SheetTotal: 7
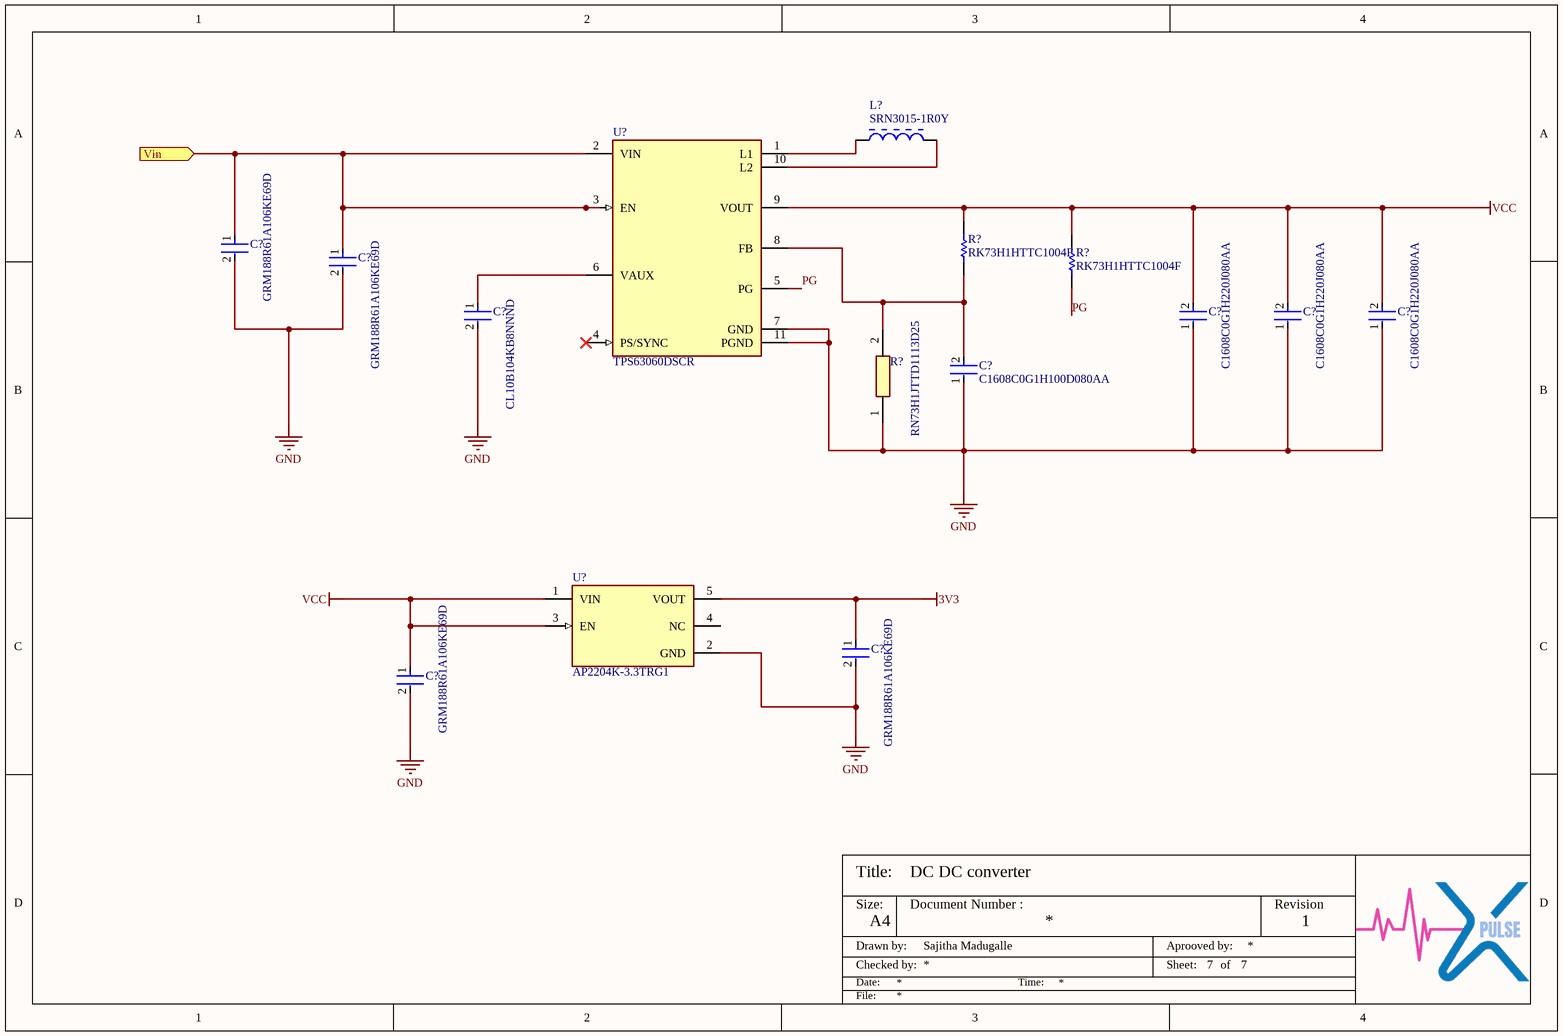
[diagram p7: Buck_converter.SchDoc]

### Parts
(Parts that share a designator on the sheet are numbered #1, #2 ... from top to bottom, then left to right.)
C?#5  GRM188R61A106KE69D  [FP-GRM18-0_15-MFG]
C?#6  GRM188R61A106KE69D  [FP-GRM18-0_15-MFG]
C?#7  CL10B104KB8NNND  [FP-CL10-IPC_A]
C?#8  C1608C0G1H220J080AA  [FP-C1608-080-0_1-IPC_B]
C?#9  C1608C0G1H220J080AA  [FP-C1608-080-0_1-IPC_B]
C?#10  C1608C0G1H220J080AA  [FP-C1608-080-0_1-IPC_B]
C?#11  C1608C0G1H100D080AA  [FP-C1608-080-0_1-IPC_C]
C?#12  GRM188R61A106KE69D  [FP-GRM18-0_15-MFG]
C?#13  GRM188R61A106KE69D  [FP-GRM18-0_15-MFG]
L?  SRN3015-1R0Y  [BOUR-SRN3015-2_V]
R?#8  RK73H1HTTC1004F  [RESC0603X26X15NL03T05]
R?#9  RK73H1HTTC1004F  [RESC0603X26X15NL03T05]
R?#10  RN73H1JTTD1113D25  [RESC1608X55N]
U?#3  TPS63060DSCR  [FP-DSC0010G-MFG]
U?#4  AP2204K-3.3TRG1  [FP-SOT25-IPC_C]

### Ports
Vin (in)

### Nets
3V3: C?#12.1 U?#4.5(VOUT)
GND: C?#5.2 C?#6.2 C?#7.2 C?#8.1 C?#9.1 C?#10.1 C?#11.1 C?#12.2 C?#13.2 R?#10.1 U?#3.7(GND) U?#3.11(PGND) U?#4.2(GND)
Vcc: C?#8.2 C?#9.2 C?#10.2 C?#13.1 R?#8.2 R?#9.2 U?#3.9(VOUT) U?#4.1(VIN) U?#4.3(EN)
PG: R?#9.1 U?#3.5(PG)
NetC?#5_1: C?#5.1 C?#6.1 U?#3.2(VIN) U?#3.3(EN) ; port Vin
NetC?#7_1: C?#7.1 U?#3.6(VAUX)
NetC?#11_2: C?#11.2 R?#8.1 R?#10.2 U?#3.8(FB)
NetL?_1: L?.1 U?#3.1(L1)
NetL?_2: L?.2 U?#3.10(L2)

Not connected (* = marked no-connect by the designer): U?#3 4(PS/SYNC)*; U?#4 4(NC)

### Notes on the sheet
- Title:
- Size:
- Document Number :
- Revision
- Drawn by:
- Checked by:
- Date:
- A4
- Time:
- Aprooved by:
- Sheet:
- of
- File:

### Library data of the parts
C?#5 C?#6 C?#12 C?#13 = CMP-2000-05448-2: as C1 on sheet MCU_watch; Device Class L1: Passive Components; ComponentLink2Description: Datasheet; Height: 0.95mm; Package: GRM18-0.15; Octopart: https://octopart.com/grm188r61a106ke69d-murata-22851381; Manufacturer Part Number: GRM188R61A106KE69D; Value: 10uF; Digikey Description: CAP CER 10UF 10V X5R 0603; Temperature Range High: +85°C; Temperature Range Low: -55°C; Temperature Characteristic: X5R; Capacitance: 10uF; RoHS: TRUE; Device Class L2: Capacitors; ComponentLink2URL: https://search.murata.co.jp/Ceramy/image/img/A01X/G101/ENG/GRM188R61A106KE69-01A.pdf; Device Class L3: Ceramic Capacitors; Lead Free: Yes; Mouser Description: Multilayer Ceramic Capacitors MLCC - SMD/SMT 0603 10uF 10volts X5R + - 10%; Category: Cap; Voltage Rating: 10V; Temperature: -55°C to +85°C; Automotive: No
C?#7 = CMP-13271-000587-1: as C3 on sheet MCU_watch; Case/Package: 0603; Depth: 0.8mm; Max Operating Temperature: 125°C; Lead Free: Lead Free; Material: Ceramic; Voltage Rating: 50V; Min Operating Temperature: -55°C; Voltage Rating (DC): 50V; Dielectric: X7R; Height: 0.8mm; Capacitance: 100nF; Thickness: 0.035inch; Radiation Hardening: No; Voltage: 50V; Packaging: Tape and Reel; Length: 1.6mm; Tolerance: 10%; Width: 0.031inch; Mount: Surface Mount; Package Quantity: 10000
C?#8-C?#10 = CMP-2000-06024-2: as C6 on sheet MCU_watch; Packaging: Tape and Reel; Termination: SMD/SMT; Case Code (Imperial): 0603; Height: 0.8mm; Capacitance: 22pF; Voltage: 50V; RoHS Compliant: Yes; Voltage Rating: 50V; Depth: 0.8mm; Case Code (Metric): 1608; Voltage Rating (DC): 50V; Construction: Flat; Max Operating Temperature: 125°C; Radiation Hardening: No; Lead Free: Lead Free; Number of Pins: 2; Case/Package: 0603; Thickness: 0.037inch; Min Operating Temperature: -55°C; Width: 0.031inch; Mount: Surface Mount; Weight: 7.1E-05oz; Series: C; Dielectric: C0G; Package Quantity: 1; Length: 1.6mm
C?#11 = CMP-08246-005843-1: Multilayer Ceramic Capacitors 10pF ±0.5pF 50V C0G SMD 0603; Temperature Coefficient: 30ppm/°C; Tolerance: 5%; Termination: SMD/SMT; REACH SVHC: No SVHC; Package Quantity: 1; Case Code (Imperial): 0603; Number of Pins: 2; Capacitance: 10pF; Length: 1.6mm; Thickness: 0.037inch; Weight: 7.1E-05oz; Voltage Rating (DC): 50V; RoHS Compliant: Yes; Width: 0.031inch; Depth: 0.8mm; Case/Package: 0603; Dielectric Material: Ceramic; Voltage: 50V; Min Operating Temperature: -55°C; Case Code (Metric): 1608; Mount: Surface Mount; Height: 0.8mm; Construction: Flat; Series: C; Packaging: Tape and Reel; Radiation Hardening: No; Max Operating Temperature: 125°C; Lead Free: Lead Free; Voltage Rating: 50V; Dielectric: C0G
L? = CMP-0007-00007-1: Semi-shielded Power Inductor, 1 uH, +/- 30%, 2.35 A, -40 to 125 degC, 3 x 3 x 1.5 mm SMD, RoHS and Halogen Free, Tape and Reel; Manufacturer: Bourns; Inductance tolerance: +/- 30%; DCR Max: 0.048 Ohm; Resistance to Solder Heat: +260 degC for 10 sec.; SRF Min: 145 MHz; Inductance: 1 uH; Isat: 2.35 A; ComponentLink3URL: http://www.bourns.com/data/global/pdfs/SRN3015.pdf; Packing: Tape and Reel; ComponentLink1Description: Manufacturer URL; DatasheetVersion: Aug-11; ComponentLink2URL: http://www.bourns.com/data/global/pdfs/SRN3015.pdf; PartNumber: SRN3015-1R0Y; ComponentLink3Description: Package Specification; RoHS: TRUE; Mounting Technology: Surface Mount; ComponentLink1URL: http://www.bourns.com/; Operating Temperature: -40 to 125 degC; Rated current: 2.35 A; PackageDescription: 2-Pin SMD, Body 3 x 3 mm, Height 1.5 mm; ComponentLink2Description: Datasheet; PackageReference: SRN3015
R?#8 R?#9 = CMP-2004-01565-1: Manufacturer: KOA Speer; Part Number: RK73H1HTTC1004F
R?#10 = RN73H1JTTD1113D25: Resistor; Manufacturer_Name: KOA Speer; Datasheet Link: https://www.mouser.com/datasheet/2/219/RN73H-12200.pdf; Height: 0.55mm; Manufacturer_Part_Number: RN73H1JTTD1113D25; Mouser Part Number: 660-RN73H1JTD1113D25; Mouser Price/Stock: https://www.mouser.co.uk/ProductDetail/KOA-Speer/RN73H1JTTD1113D25?qs=0hon8nwgHrb8JI0BK8RpbQ%3D%3D
U?#3 = CMP-04918-000043-1: IC REG BCK BST ADJ 2A 10WSON; Manufacturer: Texas Instruments; Standoff Height: 0mm; Switching Frequency: 2400kHz; Min Supply Voltage: 2.5V; Number Of Outputs: 1; Output Voltage: 2.5-8V; Max Junction Temp: +125°C; Nominal Supply Current: 30uA; Output Type: AdjustableProgrammable; Output Current: 1A; Max Supply Voltage: 12V; Max Duty Cycle: 100%; Switching Topology: Buck-Boost; Octopart: https://octopart.com/tps63060dscr-texas+instruments-21396306; ComponentLink2Description: Datasheet; Category: IC; Ambient Temperature Range High: +85°C; Ipc Land Pattern Name: DFN300X300X70-10; Automotive: No; Manufacturer Part Number: TPS63060DSCR; Mouser Description: Voltage Regulators - Switching Regulators 2.5-12Vin,2.25A Sw Crnt Limit; Lead Free: Yes; Digikey Description: IC REG BCK BST ADJ 2A 10WSON; Device Class L3: Voltage Regulators - Switching; Ambient Temperature Range Low: -40°C; Temperature: -40°C to +85°C; Package: DSC0010G; Device Class L2: Power Management ICs; Device Class L1: Integrated Circuits (ICs); ComponentLink2URL: http://www.ti.com/lit/ds/symlink/tps63060.pdf; Temperature Range High: +85°C; Height: 0.8mm; RoHS: TRUE; Temperature Range Low: -40°C
U?#4 = CMP-2000-05782-2: as U?#2 on sheet VRegulator; Weight: 0.001058oz; Min Operating Temperature: -40°C; Output Current: 150mA; Lead Free: Lead Free; Length: 3.02mm; Height: 1.3mm; Width: 1.7mm; Case/Package: SOT-23-5; Max Operating Temperature: 85°C; Package Quantity: 3000; Mount: Surface Mount; Output Voltage: 3.3V; Number of Pins: 5; Packaging: Tape and Reel; Number of Outputs: 1

## Nets that join several sheets
3V3: plsoxmeter (C12.1 IC2.9 IC2.10), VRegulator (C?#3.1 U?#2.5), Buck_converter (C?#12.1 U?#4.5)
GND: MCU_watch (14 pins), plsoxmeter (8 pins), Vibrator (Q1.2 R11.1), Buttons (C25.2 C26.2 C27.2), USB (12 pins), VRegulator (C?#3.2 C?#4.2 U?#2.2), Buck_converter (13 pins)
Vcc: MCU_watch (7 pins), plsoxmeter (C8.1 C9.1 IC1.1 IC1.3), Buttons (R15.2 R16.2 R17.2), VRegulator (C?#4.1 U?#2.1 U?#2.3), Buck_converter (9 pins)
NetIC2_2: MCU_watch (U1.28), plsoxmeter (IC2.2 R4.1)
NetIC2_3: MCU_watch (U1.27), plsoxmeter (IC2.3 R2.1)
NetR10_1: MCU_watch (U1.9), Vibrator (R10.1)
SW1: MCU_watch (U1.1), Buttons (C25.1 R15.1)
SW2: MCU_watch (U1.32), Buttons (C27.1 R17.1)
SW3: MCU_watch (U1.2), Buttons (C26.1 R16.1)